# EAGLE design growth_pcb (EAGLE 9.6.2)
REV: p2; TITLE: Elemental Growth
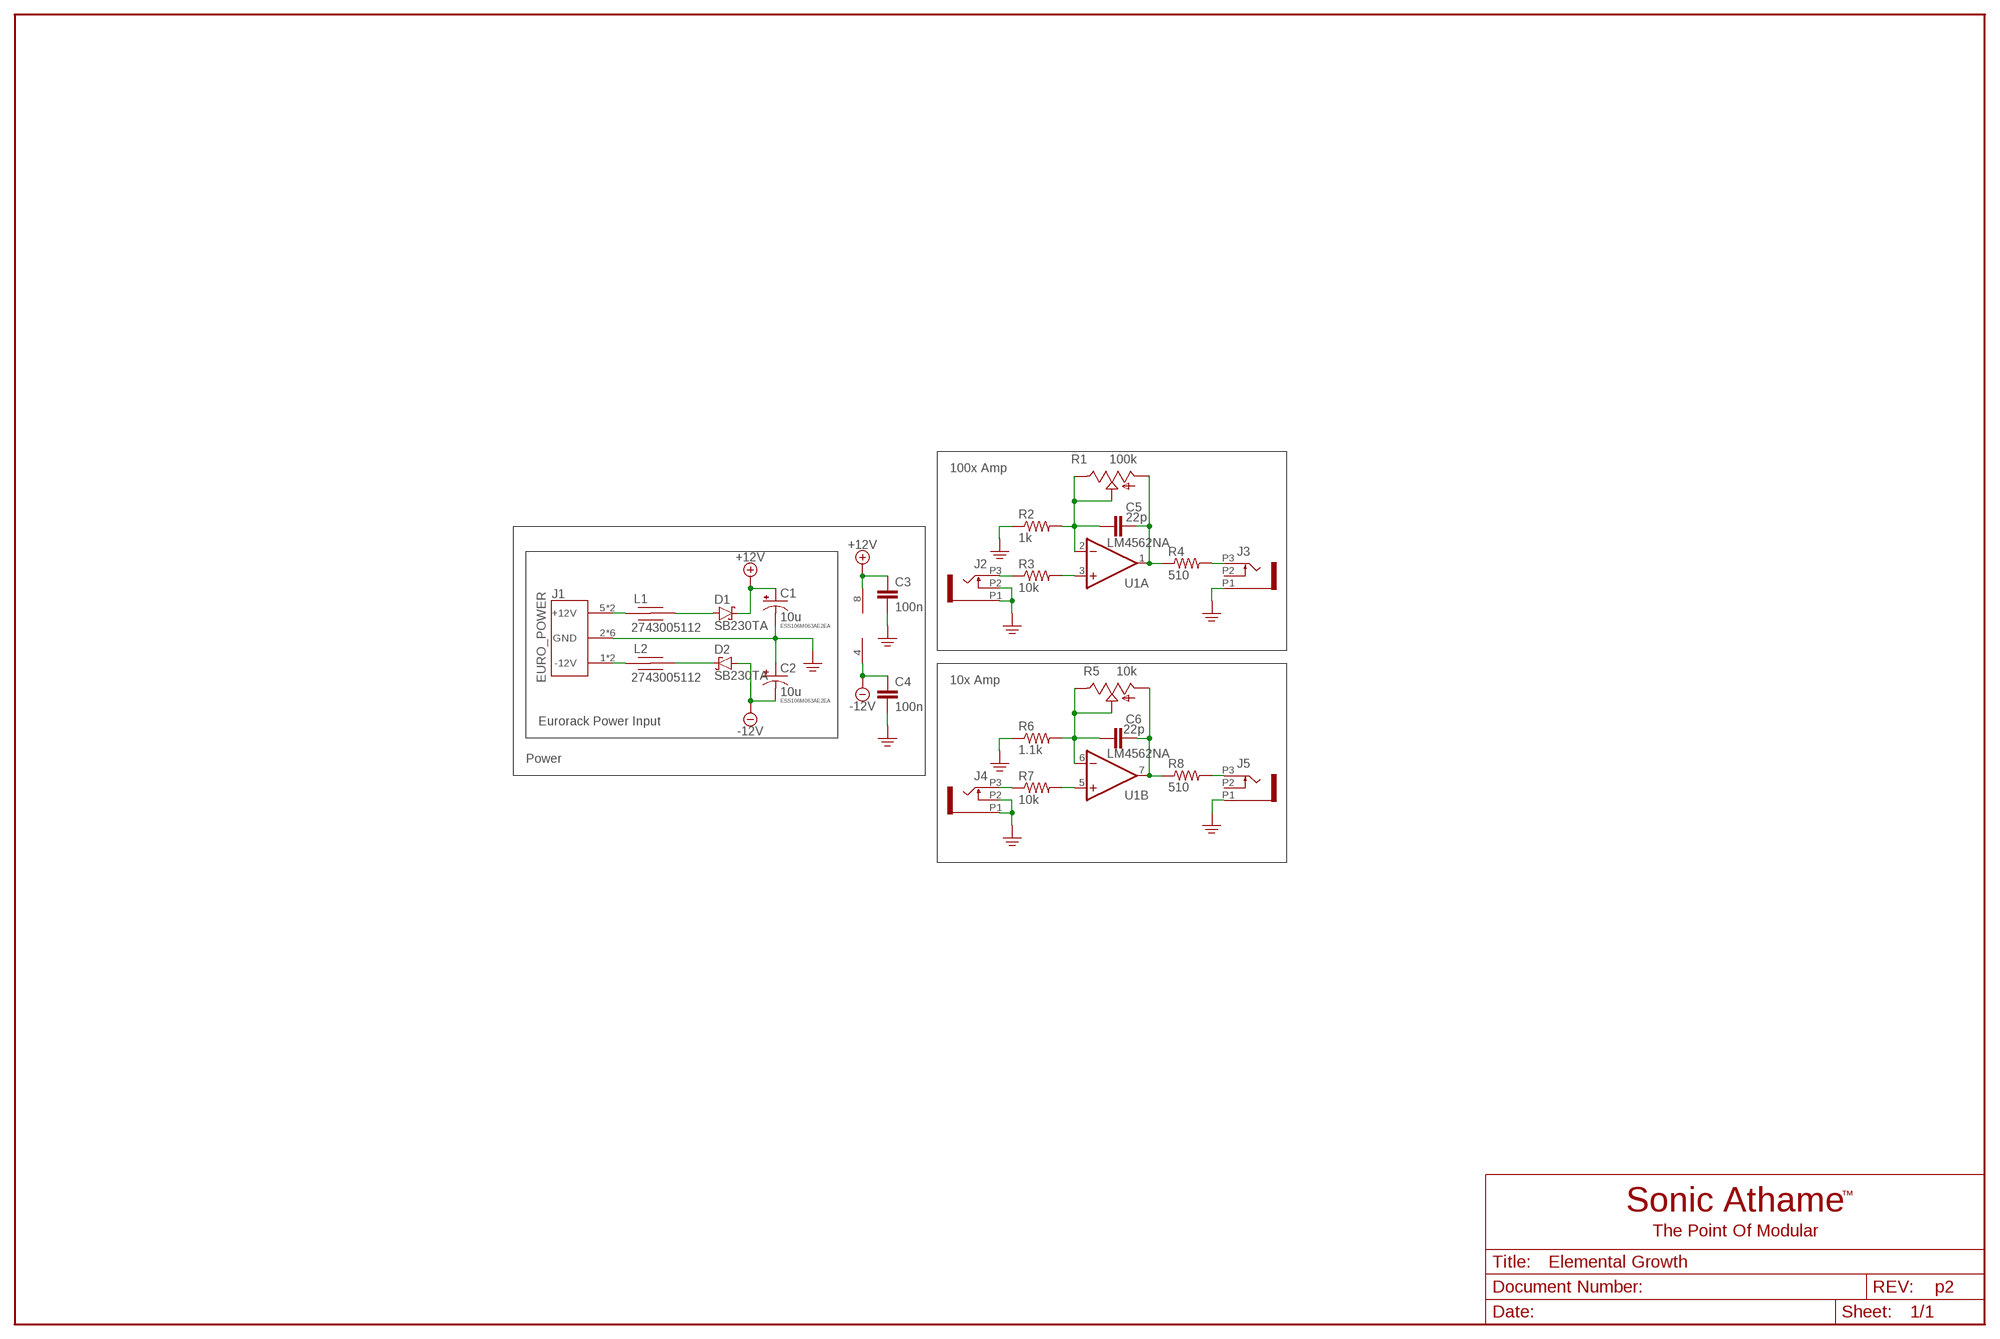
[diagram p0: schematic, sheet 1]

## Parts
C1  10u  CAP_POLLYTIC_V  [TT2D5]
C2  10u  CAP_POLLYTIC_V  [TT2D5]
C3  100n  CAP_NONPOL025-024X044  [C025-024X044]
C4  100n  CAP_NONPOL025-024X044  [C025-024X044]
C5  22p  CAP_NONPOL025-024X044  [C025-024X044]
C6  22p  CAP_NONPOL025-024X044  [C025-024X044]
D1  SB230TA  SCHOTTKY_THT  [0207/2V-POL]
D2  SB230TA  SCHOTTKY_THT  [0207/2V-POL]
J1  EURO_POWER  [EURO_POWER]
J2  WQP-PJ398SM6  [WQP_PJ_301M6]
J3  WQP-PJ398SM6  [WQP_PJ_301M6]
J4  WQP-PJ398SM6  [WQP_PJ_301M6]
J5  WQP-PJ398SM6  [WQP_PJ_301M6]
L1  2743005112  FERRITE_THT  [0207/2V]
L2  2743005112  FERRITE_THT  [0207/2V]
R1  100k  ALPHA_POT_VERTICALVERTICAL  [ALPHA_POT_VERTICAL]
R2  1k  RESISTOR0207/2V  [0207/2V]
R3  10k  RESISTOR0207/2V  [0207/2V]
R4  510  RESISTOR0207/2V  [0207/2V]
R5  10k  ALPHA_POT_VERTICALVERTICAL  [ALPHA_POT_VERTICAL]
R6  1.1k  RESISTOR0207/2V  [0207/2V]
R7  10k  RESISTOR0207/2V  [0207/2V]
R8  510  RESISTOR0207/2V  [0207/2V]
U1  LM4562NA  TL072P  [DIL08]

## Nets
+12V: C1.+ C3.1 D1.C U1.8(P:V+)
-12V: C2.- C4.1 D2.A U1.4(P:V-)
GND: C1.- C2.+ C3.2 C4.2 J1.2(GND) J1.3(GND) J1.4(GND) J1.7(GND) J1.8(GND) J1.9(GND) J2.P1 J2.P2 J3.P1 J4.P1 J4.P2 J5.P1 R2.1 R6.1
N$1: C5.1 R1.P$1(E) R1.P$2(S) R2.2 U1.2(A:-IN)
N$2: C5.2 R1.P$3(A) R4.1 U1.1(A:OUT)
N$3: R3.2 U1.3(A:+IN)
N$4: J2.P3 R3.1
N$5: J5.P3 R8.2
N$6: J3.P3 R4.2
N$7: R7.2 U1.5(B:+IN)
N$9: C6.1 R5.P$1(E) R5.P$2(S) R6.2 U1.6(B:-IN)
N$10: C6.2 R5.P$3(A) R8.1 U1.7(B:OUT)
N$11: J4.P3 R7.1
N$15: D1.A L1.2
N$16: D2.C L2.2
N$17: J1.1(-12V) J1.10(-12V) L2.1
N$18: J1.5(+12V) J1.6(+12V) L1.1
Unconnected: J3.P2 J5.P2

## Notes on the sheet
- 100x Amp
- ESS106M063AE2EA
- 10x Amp
- ESS106M063AE2EA
- Eurorack Power Input
- Power

## Library data of the parts
C1 C2 = SonicAthame:CAP_POL: POLARIZED CAPACITOR, American symbol
C3-C6 = SonicAthame:CAP_NONPOL: CAPACITOR, European symbol; SPICEPREFIX: C
D1 D2 = SonicAthame:SCHOTTKY: THT: SB230TA
J1 = SonicAthame:EURO_POWER
J2-J5 = SonicAthame:WQP-PJ398SM
L1 L2 = SonicAthame:FERRITE
R1 R5 = SonicAthame:ALPHA_POT_VERTICAL
R2-R4 R6-R8 = SonicAthame:RESISTOR: RESISTOR, American symbol; SPICEPREFIX: R
U1 = SonicAthame:TL072: OP AMP

## Board
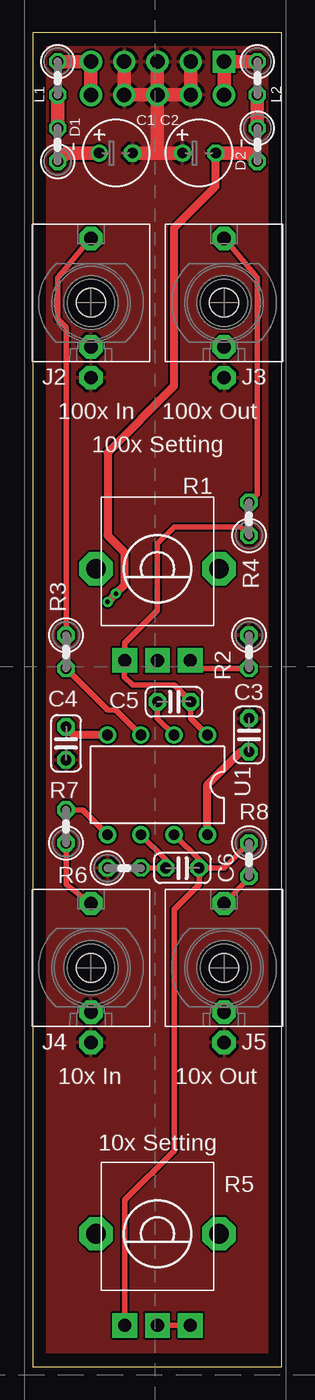
[diagram p1: board, top side]
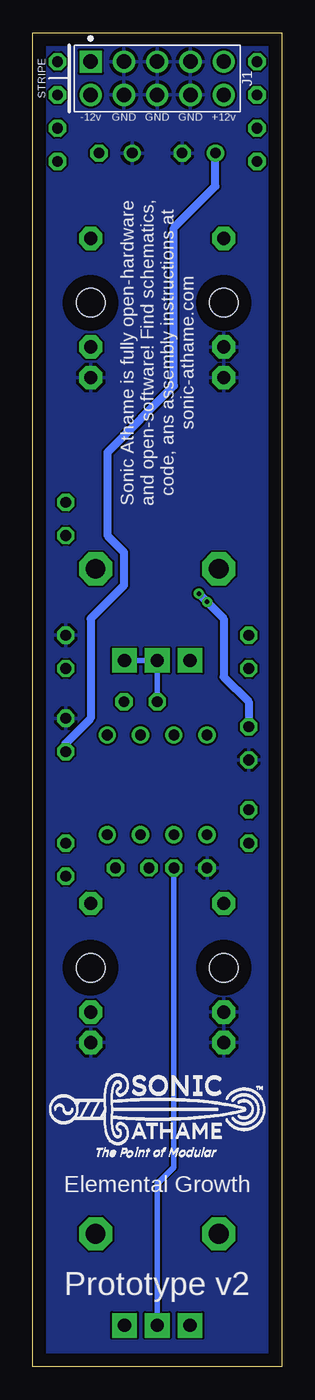
[diagram p2: board, bottom side, seen from below]

Size 19.03 x 101.91 mm. Coordinates in mm from the lower left corner, seen from the top.
Outline: 0,0 19.03,0 19.03,101.91 0,101.91 0,0
Copper layers (1*16): Top 0.035mm / dielectric 1.5mm / Bottom 0.035mm
Design rules "default": minimum track width 6mil, minimum drill 0.35mm, track to track 6mil, track to pad 6mil, pad to pad 6mil, via to via 6mil, smd to smd 6mil, copper to edge 40mil, drill to drill 6mil, minimum pad ring 10mil, minimum via ring 8mil, stop-mask expansion 4mil, vias tented up to drill 0mil, thermal gap 10mil

### Footprints (pad centres in the part's own frame; a part is rotated, then mirrored left to right if it is on the bottom)
TT2D5 = drill 0.813: + -1.27,0 | drill 0.813 octagon: - 1.27,0
C025-024X044 = drill 0.813 octagon: 1 -1.27,0; 2 1.27,0
0207/2V-POL = drill 0.813 octagon: A 1.27,0; C -1.27,0
EURO_POWER = drill 1.105 pad 1.705 square: 1 -5.08,1.27 | drill 1.105 pad 1.705: 2 -2.54,1.27; 3 0,1.27; 4 2.54,1.27; 5 5.08,1.27; 6 5.08,-1.27; 7 2.54,-1.27; 8 0,-1.27; 9 -2.54,-1.27; 10 -5.08,-1.27
WQP_PJ_301M6 = drill 1.016 pad 1.778 octagon: P1 0,-5.715; P2 0,-3.38; P3 0,4.92 | hole 2.2: 0,0
0207/2V = drill 0.813 octagon: 1 -1.27,0; 2 1.27,0
ALPHA_POT_VERTICAL = drill 1 pad 1.88 square: P$1 -2.5,7; P$2 0,7; P$3 2.5,7 | drill 1.5 pad 2.54 octagon: P$4 -4.7,0; P$5 4.7,0
DIL08 = drill 0.813 pad 1.27: 1 -3.81,-3.81; 2 -1.27,-3.81; 3 1.27,-3.81; 4 3.81,-3.81; 5 3.81,3.81; 6 1.27,3.81; 7 -1.27,3.81; 8 -3.81,3.81

### Placement (x,y rotation side)
C1  6.35,92.71 0 top
C2  12.7,92.71 0 top
C3  16.51,48.26 90 top
C4  2.54,47.62 270 top
C5  10.79,50.8 0 top
C6  11.43,38.1 0 top
D1  1.91,93.34 90 top
D2  17.14,93.34 270 top
J1  9.53,98.42 0 bottom
J2  4.45,81.28 0 top
J3  14.61,81.28 0 top
J4  4.45,30.48 0 top
J5  14.61,30.48 0 top
L1  1.91,98.42 270 top
L2  17.14,98.42 270 top
R1  9.53,60.96 180 top
R2  16.51,54.61 270 top
R3  2.54,54.61 270 top
R4  16.51,64.77 90 top
R5  9.53,10.16 180 top
R6  6.99,38.1 0 top
R7  2.54,41.27 90 top
R8  16.51,38.73 270 top
U1  9.53,44.45 180 top
U$1  [PANEL_REF_4U]  -0.64,-10.79 0 top  (outside the outline)
U$2  [LOGO-65MIL-BSILK]  9.53,19.69 0 top

### Tracks (layer width: path | path; a pad name or v marks a point on that pad's centre or on a via)
+12V
  Top 0.61: U1.8 13.34,44.45 15.88,46.99 C3.1
  Top 1.016: D1.C 2.54,92.71 C1.+
  Bottom 0.61: C3.1 16.51,47.62 14.61,49.53 14.61,57.15 12.06,59.69 12.06,62.23 13.34,63.5 13.34,69.85 8.26,74.93 8.26,87 5.08,90.17 C1.+
-12V  (via drill 0.35)
  Top 0.61: U1.4 3.17,48.26 C4.1 | v5.71,58.42 v6.35,59.05 6.99,59.69 6.99,62.23 5.71,63.5 5.71,69.85 10.79,74.93 10.79,87 13.97,90.17 C2.-
  Top 1.016: D2.A 16.51,92.71 C2.-
  Bottom 0.61: C4.1 2.54,50.8 4.45,52.7 4.45,57.15 v5.71,58.42 v6.35,59.05
GND
  Top 1.016: J1.4 J1.7 J1.8 | J1.2 J1.9 J1.8 | J1.3 J1.8 | J1.8 9.53,92.71 | 9.53,92.71 C2.+ | C1.- 9.53,92.71
  pour Bottom: -0.64,0 19.68,0 19.68,102.23 -0.64,102.23
  pour Top: -0.64,0 19.68,0 19.68,102.23 -0.64,102.23
N$1
  Top 0.406: R2.2 12.64,53.34 R1.P$1 | U1.2 9.53,49.53 C5.1
  Bottom 0.406: R1.P$1 R1.P$2 C5.1
N$2
  Top 0.406: U1.1 12.06,49.53 C5.2 10.79,52.07 7.62,52.07 6.99,52.7 6.99,54 R1.P$3 7.03,55.28 9.53,57.78 9.53,62.86 10.79,64.14 15.88,64.14 R4.1
N$3
  Top 0.406: U1.3 6.35,50.16 5.71,50.16 R3.2
N$4
  Top 0.406: R3.1 2.54,79.38 1.91,80.01 1.91,83.19 J2.P3
N$5
  Top 0.406: R8.2 16.51,37.3 J5.P3
N$6
  Top 0.406: J3.P3 17.14,83.19 17.14,66.67 R4.2
N$7
  Top 0.406: U1.5 3.81,42.55 R7.2
N$9
  Top 0.406: R5.P$2 R5.P$1 | U1.6 10.16,38.73 C6.1 R6.2
  Bottom 0.406: R6.2 8.26,15.24 9.53,13.97 R5.P$2
N$10
  Top 0.406: C6.2 12.7,38.73 U1.7 | R8.1 14.61,38.1 C6.2 | R5.P$3 7.03,12.74 10.79,16.51 10.79,34.92 12.7,36.83 C6.2
N$11
  Top 0.406: J4.P3 2.54,36.83 R7.1
N$15
  Top 1.016: L1.2 D1.A
N$16
  Top 1.016: L2.2 D2.C
N$17
  Top 1.016: J1.10 J1.1 L2.1
N$18
  Top 1.016: J1.6 J1.5 L1.1

### Text on the board
tNames: 100x In | 100x Out | 100x Setting | 10x In | 10x Out | 10x Setting
bNames: STRIPE | Sonic Athame is fully open-hardware / and open-software! Find schematics, / code, ans assembly instructions at / sonic-athame.com | Elemental Growth | Prototype v2